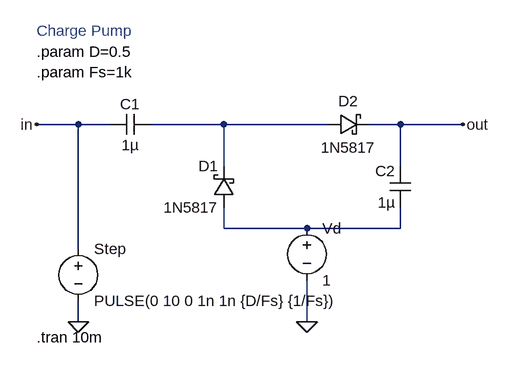
[diagram p0: schematic Charge-Pump.asc]
Charge-Pump.asc, the LTspice schematic file:
Version 4
SHEET 1 880 680
WIRE 0 160 -64 160
WIRE 48 160 0 160
WIRE 224 160 112 160
WIRE 384 160 224 160
WIRE 496 160 448 160
WIRE 592 160 496 160
WIRE 224 224 224 160
WIRE 496 224 496 160
WIRE 224 320 224 288
WIRE 352 320 224 320
WIRE 496 320 496 288
WIRE 496 320 352 320
WIRE 0 352 0 160
WIRE 0 464 0 432
WIRE 352 464 352 400
FLAG 0 464 0
FLAG 352 464 0
FLAG 592 160 out
FLAG -64 160 in
SYMBOL voltage 0 336 R0
WINDOW 123 0 0 Left 0
WINDOW 39 0 0 Left 0
SYMATTR InstName Step
SYMATTR Value PULSE(0 10 0 1n 1n {D/Fs} {1/Fs})
SYMBOL schottky 240 288 R180
WINDOW 0 24 64 Left 2
WINDOW 3 24 0 Left 2
SYMATTR InstName D1
SYMATTR Value 1N5817
SYMATTR Description Zener Diode
SYMATTR Type zener
SYMBOL schottky 384 176 R270
WINDOW 0 36 32 VTop 2
WINDOW 3 -4 32 VBottom 2
SYMATTR InstName D2
SYMATTR Value 1N5817
SYMATTR Description Zener Diode
SYMATTR Type zener
SYMBOL cap 112 144 R90
WINDOW 0 0 32 VBottom 2
WINDOW 3 32 32 VTop 2
SYMATTR InstName C1
SYMATTR Value 1µ
SYMBOL cap 512 288 R180
WINDOW 0 24 56 Left 2
WINDOW 3 24 8 Left 2
SYMATTR InstName C2
SYMATTR Value 1µ
SYMBOL voltage 352 304 R0
SYMATTR InstName Vd
SYMATTR Value 1
TEXT -64 16 Left 2 ;Charge Pump
TEXT -64 48 Left 2 !.param D=0.5\n.param Fs=1k
TEXT -64 488 Left 2 !.tran 10m

The netlist it stands for:
* Charge-Pump.asc
V§Step in 0 PULSE(0 10 0 1n 1n {D/Fs} {1/Fs})
D1 N002 N001 1N5817
D2 N001 out 1N5817
C1 N001 in 1µ
C2 N002 out 1µ
Vd N002 0 1
.model D D
.lib standard.dio
* Charge Pump
.param D=0.5
.param Fs=1k
.tran 10m
.backanno
.end